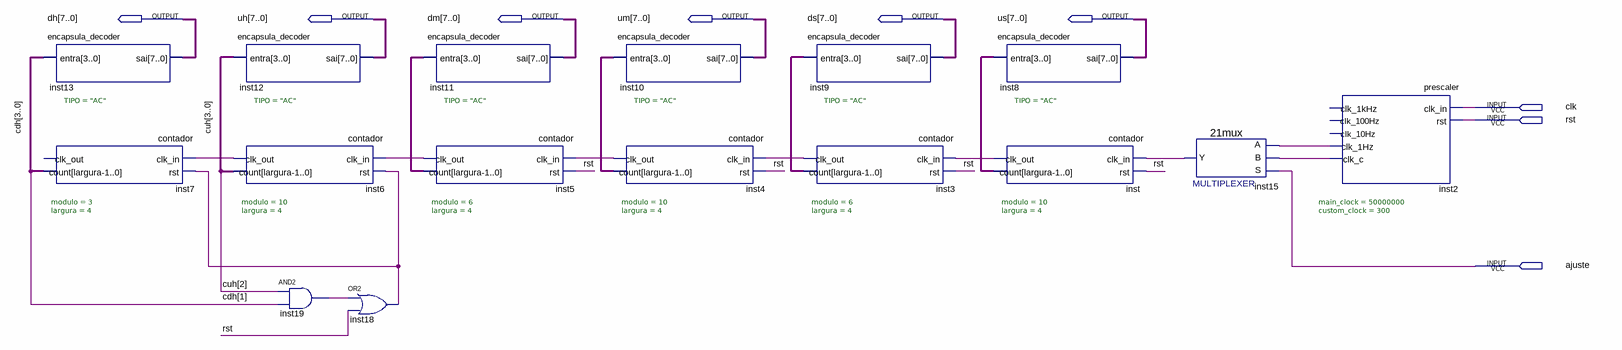
[diagram p0: schematic sheet]
// Quartus schematic SE13_Relogio_Aula_Sch.bdf as structural Verilog: 16 symbols, 9 pins
module SE13_Relogio_Aula_Sch (
  input  clk,
  input  rst,
  input  ajuste,
  output [7:0] dh,
  output [7:0] uh,
  output [7:0] dm,
  output [7:0] um,
  output [7:0] ds,
  output [7:0] us
);

  wire inst2_clk_1hz, inst2_clk_c, inst3_clk_out, inst4_clk_out, inst5_clk_out, inst6_clk_out, inst15_y,
       inst18_out, inst19_out, inst_clk_out;
  wire [3:0] cdh, cuh, inst3_count, inst4_count, inst5_count, inst_count;

  encapsula_decoder #(.TIPO("AC")) inst13 (.entra(cdh), .sai(dh));
  contador #(.modulo(3), .largura(4)) inst7 (.clk_in(inst6_clk_out), .rst(inst18_out), .count(cdh));  // open: clk_out
  encapsula_decoder #(.TIPO("AC")) inst12 (.entra(cuh), .sai(uh));
  contador #(.modulo(10), .largura(4)) inst6 (
    .clk_in(inst5_clk_out), .rst(inst18_out), .clk_out(inst6_clk_out), .count(cuh));
  and inst19 (inst19_out, cuh[2], cdh[1]);
  or inst18 (inst18_out, inst19_out, rst);
  encapsula_decoder #(.TIPO("AC")) inst11 (.entra(inst5_count), .sai(dm));
  contador #(.modulo(6), .largura(4)) inst5 (
    .clk_in(inst4_clk_out), .rst(rst), .clk_out(inst5_clk_out), .count(inst5_count));
  encapsula_decoder #(.TIPO("AC")) inst10 (.entra(inst4_count), .sai(um));
  contador #(.modulo(10), .largura(4)) inst4 (
    .clk_in(inst3_clk_out), .rst(rst), .clk_out(inst4_clk_out), .count(inst4_count));
  encapsula_decoder #(.TIPO("AC")) inst9 (.entra(inst3_count), .sai(ds));
  contador #(.modulo(6), .largura(4)) inst3 (
    .clk_in(inst_clk_out), .rst(rst), .clk_out(inst3_clk_out), .count(inst3_count));
  encapsula_decoder #(.TIPO("AC")) inst8 (.entra(inst_count), .sai(us));
  contador #(.modulo(10), .largura(4)) inst (.clk_in(inst15_y), .rst(rst), .clk_out(inst_clk_out), .count(inst_count));
  \21mux  inst15 (.S(ajuste), .B(inst2_clk_c), .A(inst2_clk_1hz), .Y(inst15_y));
  prescaler #(.main_clock(50000000), .custom_clock(300)) inst2 (
    .clk_in(clk), .rst(rst), .clk_1Hz(inst2_clk_1hz), .clk_c(inst2_clk_c));  // open: clk_1kHz, clk_100Hz, clk_10Hz
endmodule
